# Altium project PLC_ESP32.PrjPcb
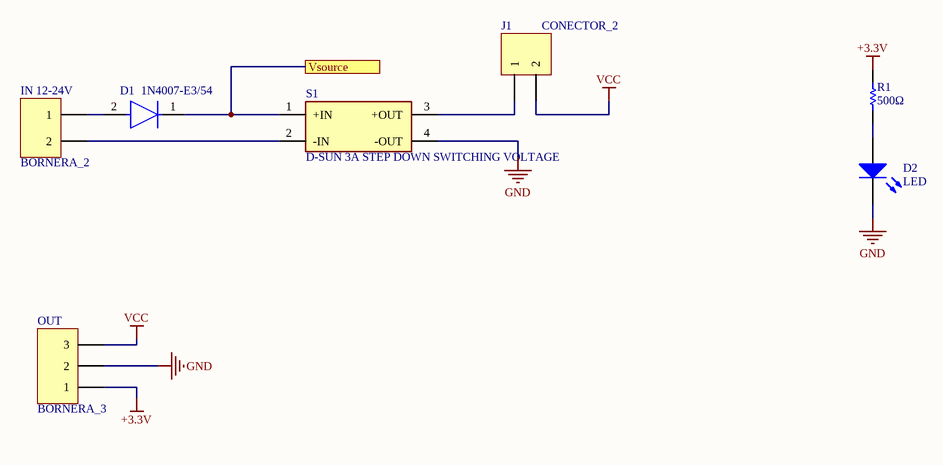
[diagram p0: source.SchDoc]
3 sheets, 14 parts. Net scope: flat (ports and power ports of the same name join across sheets).
Board file: PCB1.PcbDoc
Sheets:
  source.SchDoc
  esquematico.SchDoc
  borneras.SchDoc

## Sheet source.SchDoc
size A4; SheetNumber: 1; SheetTotal: 3

### Parts
D1  1N4007-E3/54  [FP-1N4007-MFG]
D2  LED  [FP-LED]
IN_12-24V  BORNERA_2  [BORNERA_2]
J1  CONECTOR_2  [PCBComponent_1]
OUT  BORNERA_3  [BORNERA_3]
R1  500Ω  [FP-RESISTENCIA]
S1  D-SUN 3A STEP DOWN SWITCHING VOLTAGE  [STEP_SOURCE]

### Ports
Vsource

### Nets
+3.3V: OUT.1 R1.1
GND: D2.2(K) OUT.2 S1.4(-OUT)
VCC: J1.2 OUT.3
NetD1_1: D1.1(C) S1.1(+IN) ; port Vsource
NetD1_2: D1.2(A) IN_12-24V.1
NetD2_1: D2.1(A) R1.2
NetIN_12-24V_2: IN_12-24V.2 S1.2(-IN)
NetJ1_1: J1.1 S1.3(+OUT)

### Library data of the parts
D1 = CMP-02540-000046-1: DIODE GEN PURP 1KV 1A DO204AL; Manufacturer: Vishay; Value: 15pF; Max Junction Temp: +150°C; Max Surge Forward Current: 30A; Max Repetitive Reverse Voltage: 1000V; Peak Reverse Current: 30uA; Octopart: https://octopart.com/1n4007-e3%2F54-vishay-39548207; Digikey Description: DIODE GEN PURP 1KV 1A DO204AL; Category: Diode; Mouser Description: Rectifiers Vr/1000V Io/1A; Automotive: No; Package: 1N4007; Device Class L3: Rectifier Diodes; Temperature Range High: +150°C; Capacitance: 15pF; Ipc Land Pattern Name: DIOPA1088W105L520D270; Lead Free: Yes; ComponentLink2Description: Datasheet; Forward Current: 1A; Device Class L1: Discrete Semiconductors; ComponentLink2URL: http://www.vishay.com/docs/88503/1n4001.pdf; Temperature Range Low: -50°C; Height: 2.7mm; RoHS: TRUE; Temperature: -50°C to +150°C; Device Class L2: Diodes; Manufacturer Part Number: 1N4007-E3/54
R1 = Resistencia

## Sheet esquematico.SchDoc
size A4; SheetNumber: 2; SheetTotal: 3
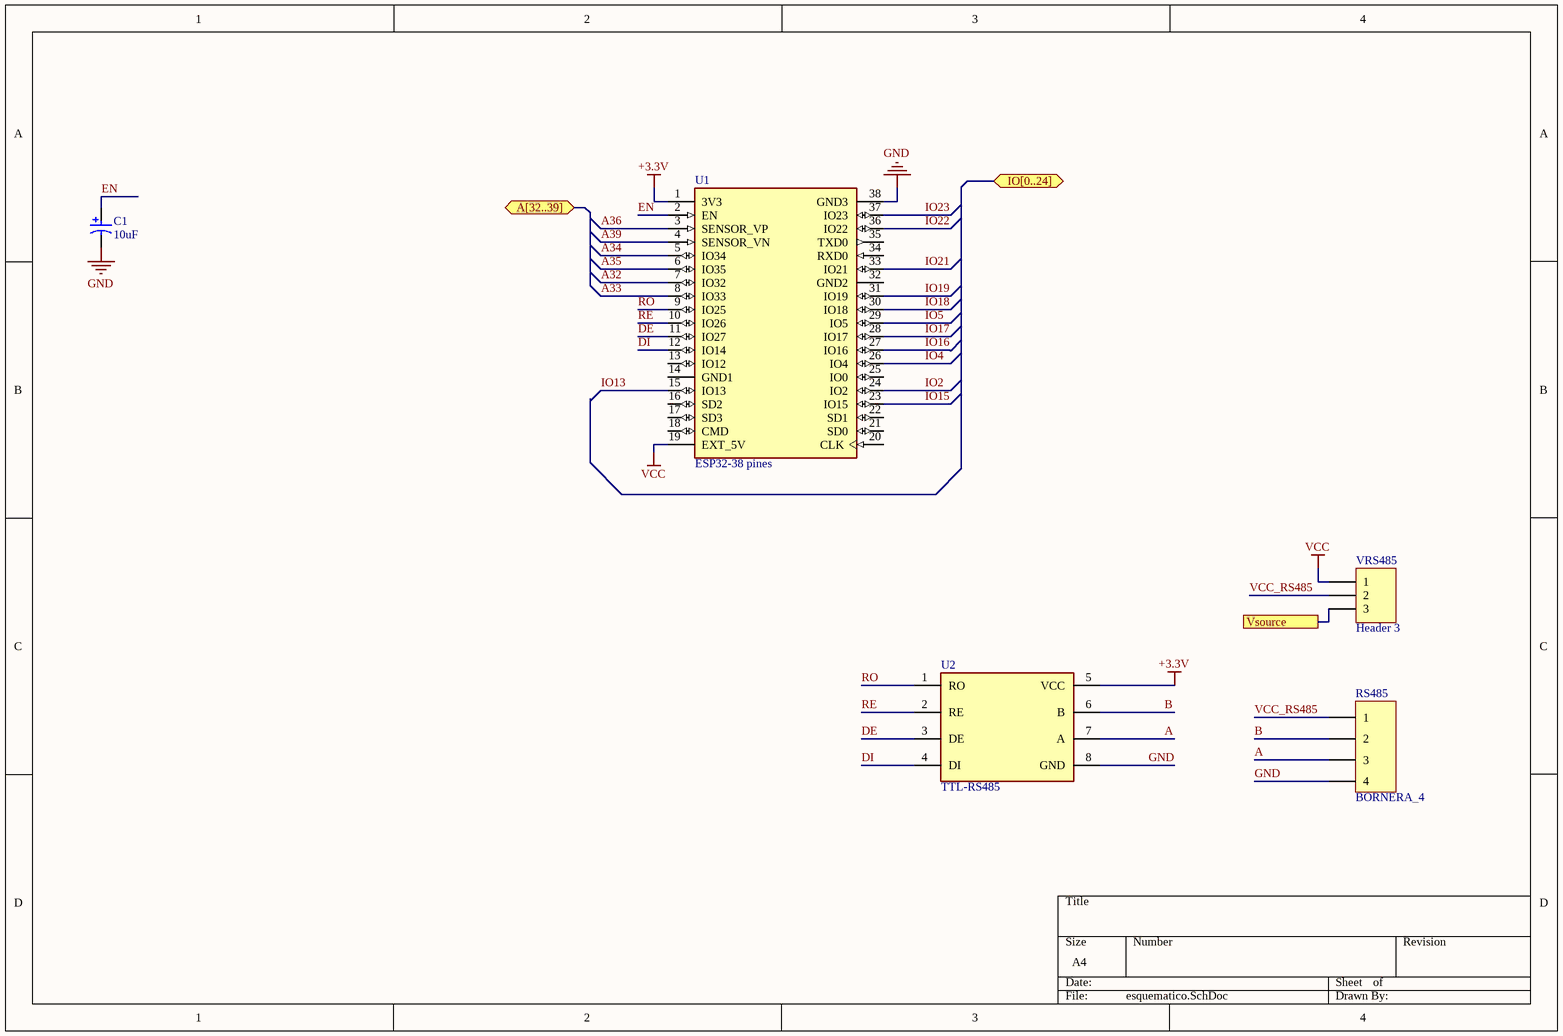
[diagram p1: esquematico.SchDoc]

### Parts
C1  10uF  [FP-CAPACITOR]
RS485  BORNERA_4  [BORNERA_4]
U1  ESP32-38 pines  [ESP32]
U2  TTL-RS485  [TTL_RS485]
VRS485  Header 3  [HDR1X3]

### Ports
A[32..39] (bidir), IO[0..24] (bidir), Vsource

### Nets
+3.3V: U1.1(3V3) U2.5(VCC)
GND: C1.2 RS485.4 U1.38(GND3) U2.8(GND)
VCC: U1.19(EXT_5V) VRS485.1
A: RS485.3 U2.7(A)
A32: U1.7(IO32)
A33: U1.8(IO33)
A34: U1.5(IO34)
A35: U1.6(IO35)
A36: U1.3(SENSOR_VP)
A39: U1.4(SENSOR_VN)
B: RS485.2 U2.6(B)
DE: U1.11(IO27) U2.3(DE)
DI: U1.12(IO14) U2.4(DI)
EN: C1.1 U1.2(EN)
IO2: U1.24(IO2)
IO4: U1.26(IO4)
IO5: U1.29(IO5)
IO13: U1.15(IO13)
IO15: U1.23(IO15)
IO16: U1.27(IO16)
IO17: U1.28(IO17)
IO18: U1.30(IO18)
IO19: U1.31(IO19)
IO21: U1.33(IO21)
IO22: U1.36(IO22)
IO23: U1.37(IO23)
RE: U1.10(IO26) U2.2(RE)
RO: U1.9(IO25) U2.1(RO)
VCC_RS485: RS485.1 VRS485.2
NetD1_1: VRS485.3 ; port Vsource

Not connected (* = marked no-connect by the designer): U1 13(IO12) 14(GND1) 16(SD2) 17(SD3) 18(CMD) 20(CLK) 21(SD0) 22(SD1) 25(IO0) 32(GND2) 34(RXD0) 35(TXD0)

### Library data of the parts
C1 = Electrolytic capacitor
VRS485 = Header 3: Header, 3-Pin; LatestRevisionDate: 17-Jul-2002; LatestRevisionNote: Re-released for DXP Platform.; Publisher: Altium Limited

## Sheet borneras.SchDoc
size A4; SheetNumber: 3; SheetTotal: 3
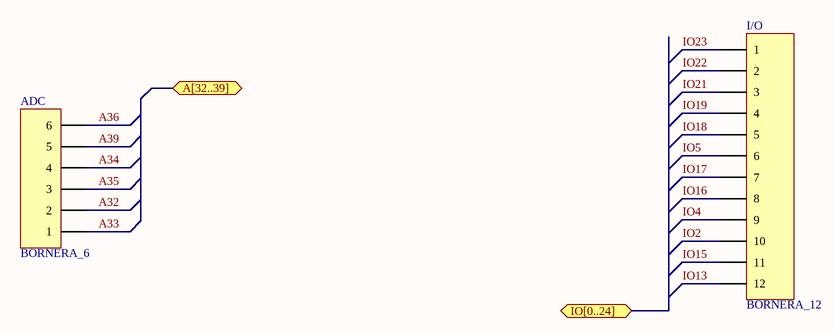
[diagram p2: borneras.SchDoc]

### Parts
ADC  BORNERA_6  [BORNERA_6]
I/O  BORNERA_12  [BORNERA_12]

### Ports
A[32..39] (bidir), IO[0..24] (bidir)

### Nets
A32: ADC.2
A33: ADC.1
A34: ADC.4
A35: ADC.3
A36: ADC.6
A39: ADC.5
IO2: I/O.10
IO4: I/O.9
IO5: I/O.6
IO13: I/O.12
IO15: I/O.11
IO16: I/O.8
IO17: I/O.7
IO18: I/O.5
IO19: I/O.4
IO21: I/O.3
IO22: I/O.2
IO23: I/O.1

## Nets that join several sheets
+3.3V: source (OUT.1 R1.1), esquematico (U1.1 U2.5)
GND: source (D2.2 OUT.2 S1.4), esquematico (C1.2 RS485.4 U1.38 U2.8)
VCC: source (J1.2 OUT.3), esquematico (U1.19 VRS485.1)
NetD1_1: source (D1.1 S1.1), esquematico (VRS485.3)